# Altium schematic sheet BaseNode.SchDoc
size D
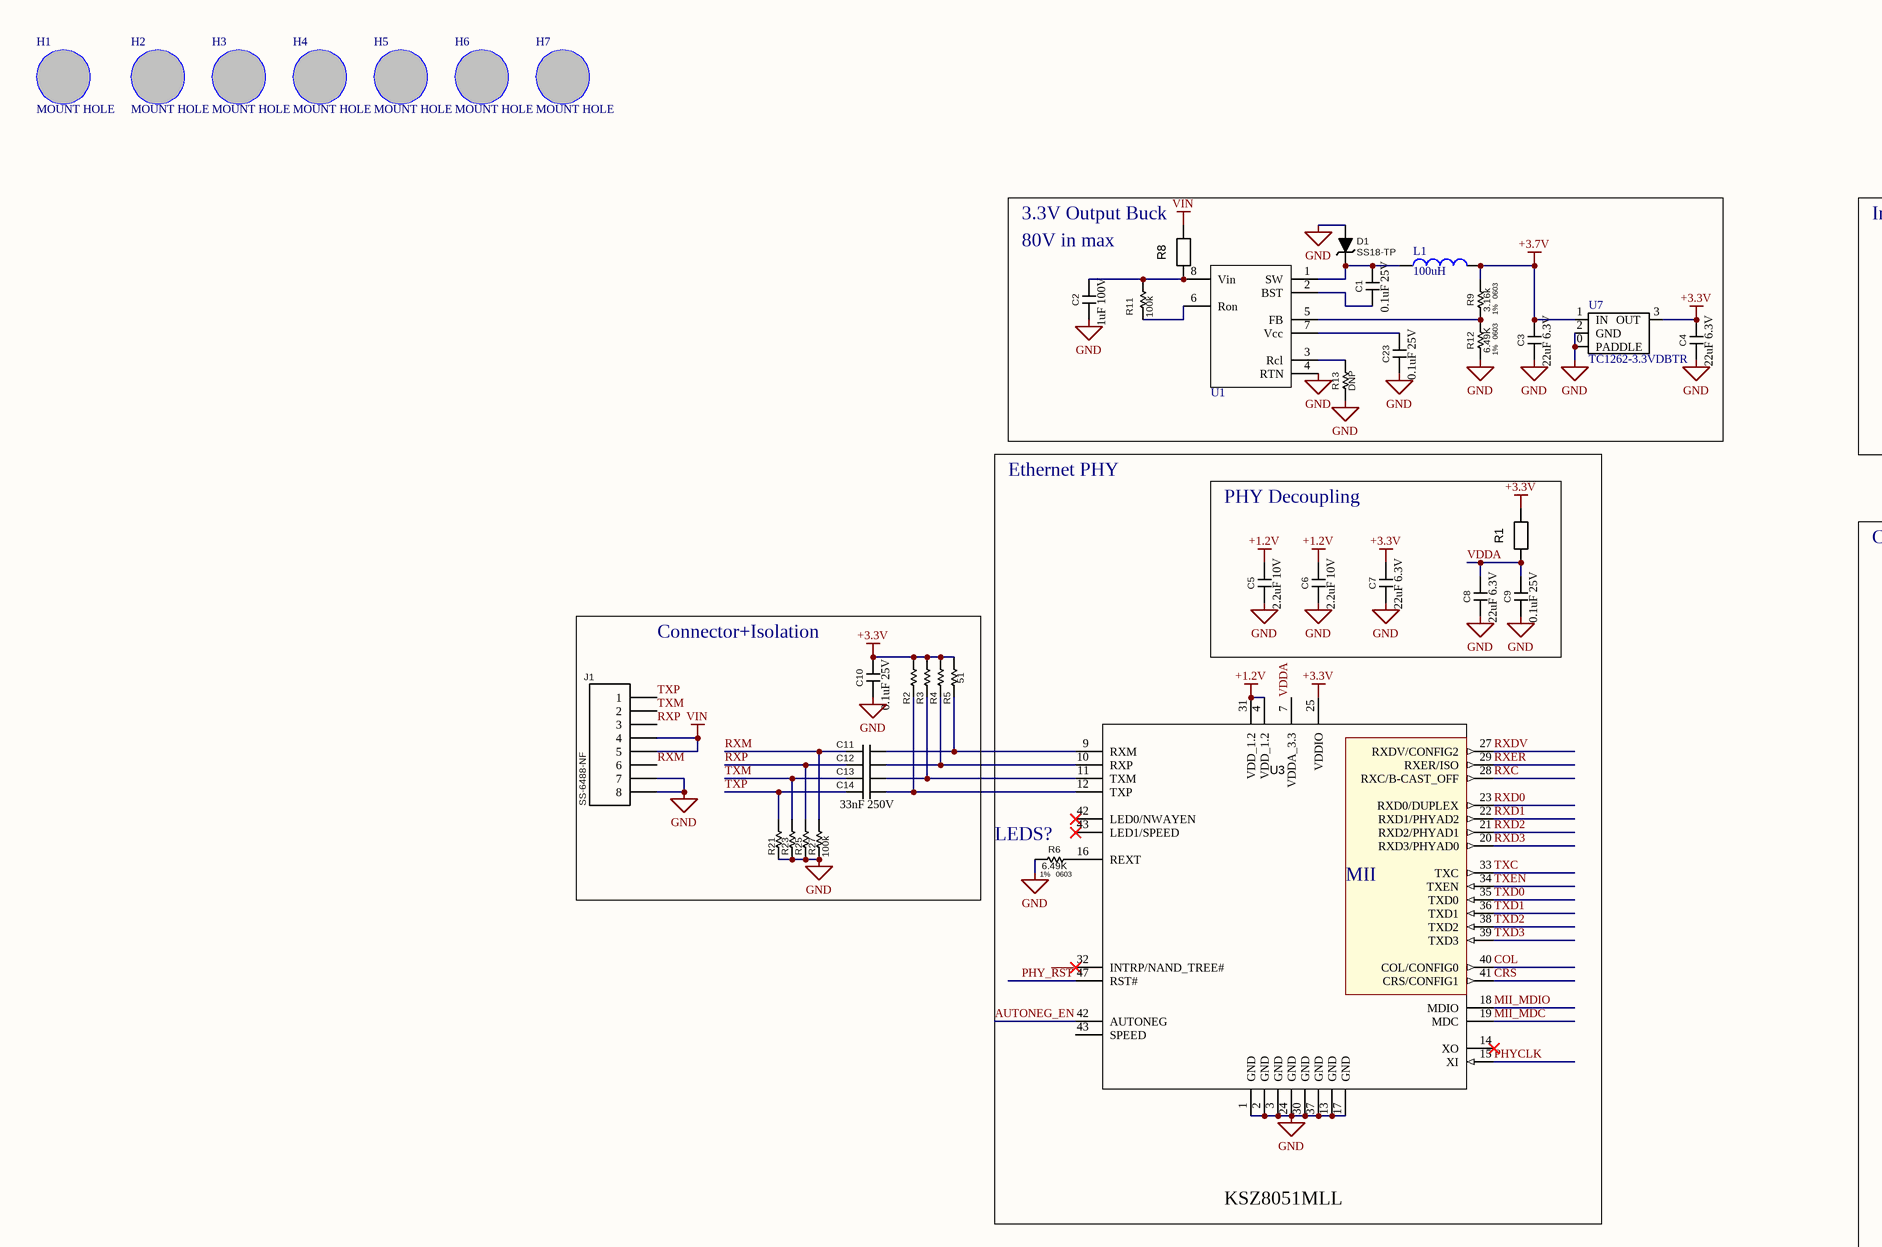
[diagram p0: BaseNode.SchDoc, top left]
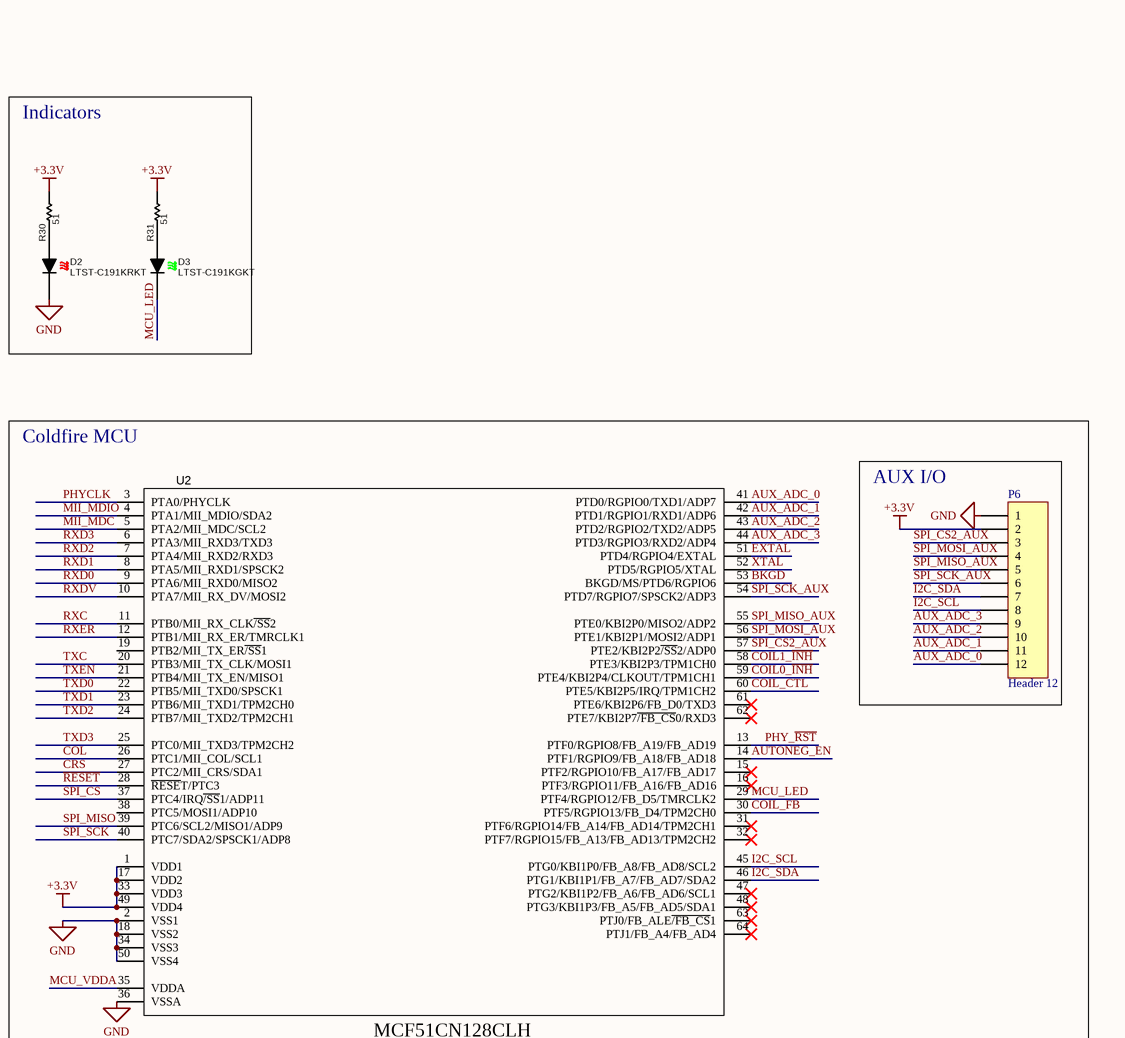
[diagram p1: BaseNode.SchDoc, top right]
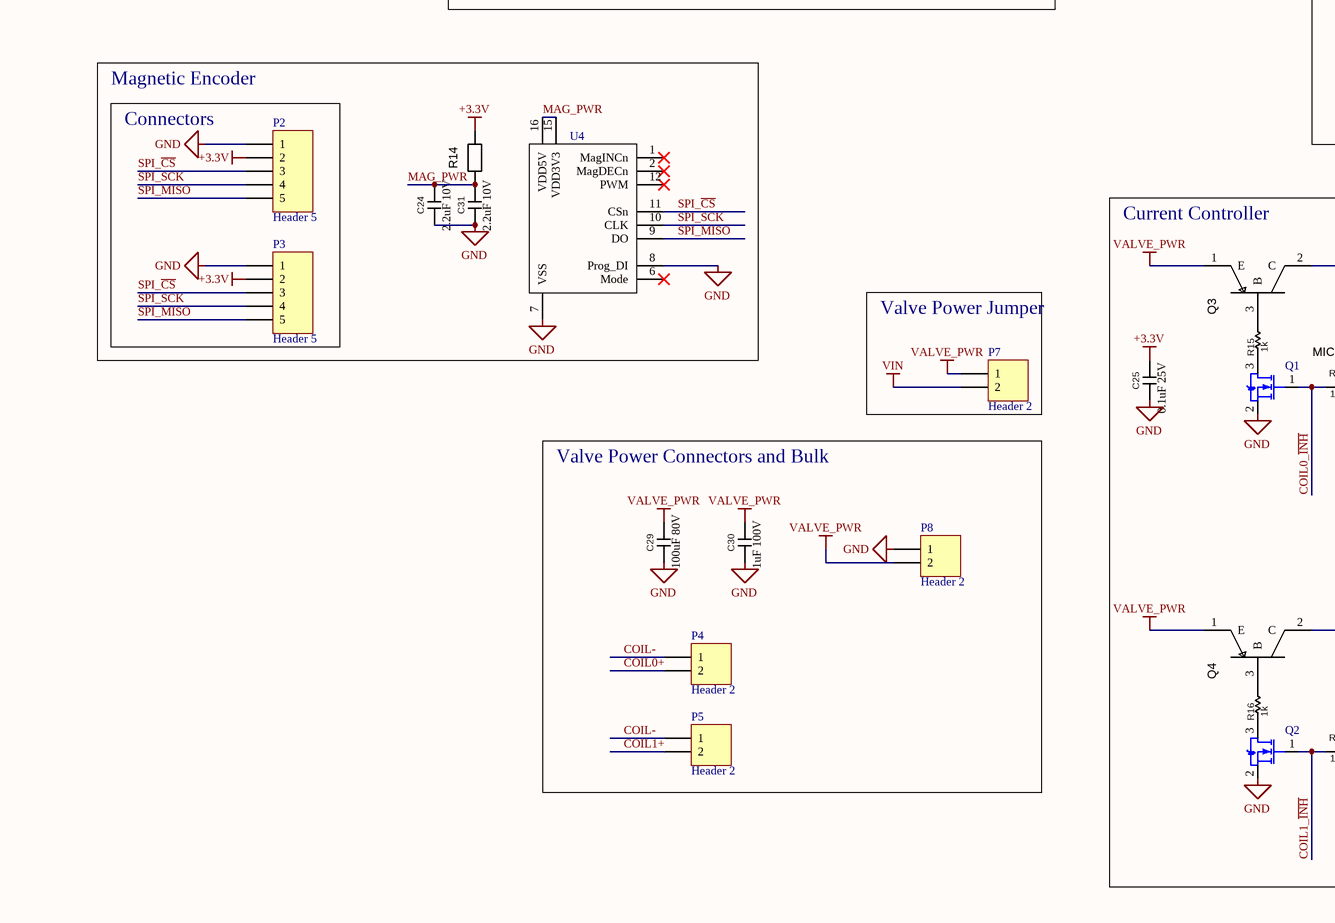
[diagram p2: BaseNode.SchDoc, bottom left]
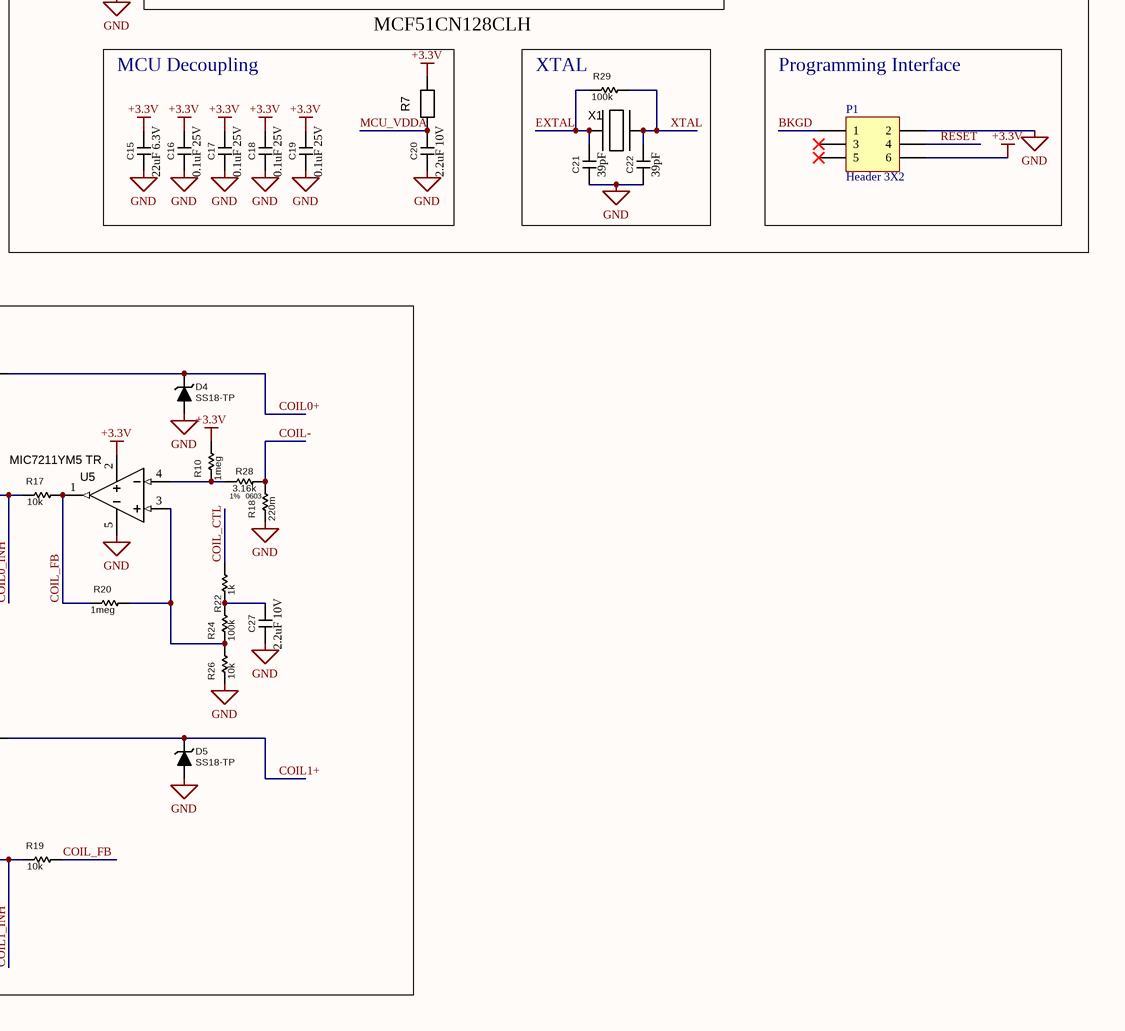
[diagram p3: BaseNode.SchDoc, bottom right]

## Parts
C1  0.1uF 25V  [0603]
C2  1uF 100V  [0805]
C3  22uF 6.3V  [1206]
C4  22uF 6.3V  [1206]
C5  2.2uF 10V  [0603]
C6  2.2uF 10V  [0603]
C7  22uF 6.3V  [1206]
C8  22uF 6.3V  [1206]
C9  0.1uF 25V  [0603]
C10  0.1uF 25V  [0603]
C11  33nF 250V  [0805]
C12  33nF 250V  [0805]  (value not drawn)
C13  33nF 250V  [0805]  (value not drawn)
C14  33nF 250V  [0805]  (value not drawn)
C15  22uF 6.3V  [1206]
C16  0.1uF 25V  [0603]
C17  0.1uF 25V  [0603]
C18  0.1uF 25V  [0603]
C19  0.1uF 25V  [0603]
C20  2.2uF 10V  [0603]
C21  39pF  [0603]
C22  39pF  [0603]
C23  0.1uF 25V  [0603]
C24  2.2uF 10V  [0603]
C25  0.1uF 25V  [0603]
C27  2.2uF 10V  [0603]
C29  100uF 80V  [Capacitor 12mm DIA POLAR]
C30  1uF 100V  [0805]
C31  2.2uF 10V  [0603]
D1  ManufacturerPN: SS18-TP  [SMA-DIODE]  (hidden comment: CDBA140-G)
D2  ManufacturerPN: LTST-C191KRKT  [0603 - LED]  (hidden comment: WP113IDT)
D3  ManufacturerPN: LTST-C191KGKT  [0603 - LED]  (hidden comment: WP113GDT)
D4  ManufacturerPN: SS18-TP  [SMA-DIODE]  (hidden comment: CDBA140-G)
D5  ManufacturerPN: SS18-TP  [SMA-DIODE]  (hidden comment: CDBA140-G)
H1  MOUNT HOLE  [MOUNT_HOLE]
H2  MOUNT HOLE  [MOUNT_HOLE]
H3  MOUNT HOLE  [MOUNT_HOLE]
H4  MOUNT HOLE  [MOUNT_HOLE]
H5  MOUNT HOLE  [MOUNT_HOLE]
H6  MOUNT HOLE  [MOUNT_HOLE]
H7  MOUNT HOLE  [MOUNT_HOLE]
J1  SS-6488-NF  [SS-6488-NF]
L1  value 100uH  [NR6028 Inductor]  (hidden comment: Inductor)
P1  Header 3X2  [HDR2X3]
P2  Header 5  [HDR1X5]
P3  Header 5  [HDR1X5]
P4  Header 2  [HDR1X2]
P5  Header 2  [HDR1X2]
P6  Header 12  [HDR1X12]
P7  Header 2  [HDR1X2]
P8  Header 2  [HDR1X2]
Q1  NFET  [SOT-23]  (value not drawn)
Q2  NFET  [SOT-23]  (value not drawn)
Q3  (no value)  [SOT-89 - PBSS305PX]
Q4  (no value)  [SOT-89 - PBSS305PX]
R1  LM4041EIM3X-1.2_1  [0603]  (value not drawn)
R2  51  [0603]
R3  51  [0603]  (value not drawn)
R4  51  [0603]  (value not drawn)
R5  51  [0603]  (value not drawn)
R6  6.49K  Tolerance: 1%  [0603]
R7  LM4041EIM3X-1.2_1  [0603]  (value not drawn)
R8  LM4041EIM3X-1.2_1  [0603]  (value not drawn)
R9  3.16k  Tolerance: 1%  [0603]
R10  1meg  [0603]
R11  100k  [0603]
R12  6.49K  Tolerance: 1%  [0603]
R13  DNP  [0603]
R14  LM4041EIM3X-1.2_1  [0603]  (value not drawn)
R15  1k  [0603]
R16  1k  [0603]
R17  10k  [0603]
R18  220m  [0805]
R19  10k  [0603]
R20  1meg  [0603]
R21  100k  [0603]  (value not drawn)
R22  1k  [0603]
R23  100k  [0603]  (value not drawn)
R24  100k  [0603]
R25  100k  [0603]  (value not drawn)
R26  10k  [0603]
R27  100k  [0603]
R28  3.16k  Tolerance: 1%  [0603]
R29  100k  [0603]
R30  51  [0603]
R31  51  [0603]
U1  LM5007MM/NOPB  [MSOP-8]  (value not drawn)
U2  MCF51CN128CLH  [LQFP-64 10x10mm .5mm pitch]  (value not drawn)
U3  KSZ8051MLL  [LQFP-48 7x7mm 0.5mm pitch]  (value not drawn)
U4  AS5045-ASSU  [SSOP-16]  (value not drawn)
U5  MIC7211YM5 TR  [SOT-23-5]
U7  TC1262-3.3VDBTR  [SOT-223]
X1  ECS-250-20-3X-EN-TR  [CSM-3X]  (value not drawn)

## Blocks framed on the sheet
Indicators: D2 D3 R30 R31
PHY Decoupling: C5-C9 R1
Coldfire MCU: U2
AUX I/O: P6
Connector+Isolation: C10-C14 J1 R2-R5 R21 R23 R25 R27
MCU Decoupling: C15-C20 R7
XTAL: C21 C22 R29 X1
Programming Interface: P1
Current Controller: C25 C27 D4 D5 Q1-Q4 R10 R15-R20 R22 R24 R26 R28 U5
Valve Power Jumper: P7
Valve Power Connectors and Bulk: C29 C30 P4 P5 P8

## Nets
+1.2V: C5.2 C6.2 U3.4(VDD_1.2) U3.31(VDD_1.2)
+3.3V: C4.2 C7.2 C10.2 C15.2 C16.2 C17.2 C18.2 C19.2 C25.2 P1.6 P2.2 P3.2 P6.2 R1.1(K) R2.2 R3.2 R4.2 R5.2 R7.1(K) R10.2 R14.1(K) R30.2 R31.2 U2.1(VDD1) U2.17(VDD2) U2.33(VDD3) U2.49(VDD4) U3.25(VDDIO) U5.2(V+) U7.3(OUT)
+3.7V: C3.2 L1.2 R9.2 U7.1(IN)
GND: C2.1 C3.1 C4.1 C5.1 C6.1 C7.1 C8.1 C9.1 C10.1 C15.1 C16.1 C17.1 C18.1 C19.1 C20.1 C21.1 C22.1 C23.1 C24.1 C25.1 C27.1 C29.1 C30.1 C31.1 D1.A D2.K D4.A D5.A J1.7 J1.8 P1.2 P2.1 P3.1 P6.1 P8.1 Q1.2 Q2.2 R6.1 R12.1 R13.1 R18.1 R21.1 R23.1 R25.1 R26.1 R27.1 U1.4(RTN) U2.2(VSS1) U2.18(VSS2) U2.34(VSS3) U2.36(VSSA) U2.50(VSS4) U3.1(GND) U3.2(GND) U3.3(GND) U3.13(GND) U3.17(GND) U3.24(GND) U3.30(GND) U3.37(GND) U4.7(VSS) U4.8(Prog_DI) U5.5(V-) U7.0(PADDLE) U7.2(GND)
VALVE_PWR: C29.2 C30.2 P7.1 P8.2 Q3.1(E) Q4.1(E)
VIN: J1.4 J1.5 P7.2 R8.1(K)
AUTONEG_EN: U2.14(PTF1/RGPIO9/FB_A18/FB_AD18) U3.42(LED0/NWAYEN)
AUX_ADC_0: P6.12 U2.41(PTD0/RGPIO0/TXD1/ADP7)
AUX_ADC_1: P6.11 U2.42(PTD1/RGPIO1/RXD1/ADP6)
AUX_ADC_2: P6.10 U2.43(PTD2/RGPIO2/TXD2/ADP5)
AUX_ADC_3: P6.9 U2.44(PTD3/RGPIO3/RXD2/ADP4)
BKGD: P1.1 U2.53(BKGD/MS/PTD6/RGPIO6)
COIL0+: D4.K P4.2 Q3.2(C)
COIL0_~{INH}: Q1.1(G) R17.1 U2.59(PTE4/KBI2P4/CLKOUT/TPM1CH1)
COIL1+: D5.K P5.2 Q4.2(C)
COIL1_~{INH}: Q2.1(G) R19.1 U2.58(PTE3/KBI2P3/TPM1CH0)
COIL-: P4.1 P5.1 R18.2 R28.2
COIL_CTL: R22.2 U2.60(PTE5/KBI2P5/IRQ/TPM1CH2)
COIL_FB: R17.2 R19.2 R20.1 U2.30(PTF5/RGPIO13/FB_D4/TPM2CH0) U5.1(Out_A)
COL: U2.26(PTC1/MII_COL/SCL1) U3.40(COL/CONFIG0)
CRS: U2.27(PTC2/MII_CRS/SDA1) U3.41(CRS/CONFIG1)
EXTAL: C21.2 R29.1 U2.51(PTD4/RGPIO4/EXTAL) X1.2(A)
I2C_SCL: P6.8 U2.45(PTG0/KBI1P0/FB_A8/FB_AD8/SCL2)
I2C_SDA: P6.7 U2.46(PTG1/KBI1P1/FB_A7/FB_AD7/SDA2)
MAG_PWR: C24.2 C31.2 R14.2(A) U4.15(VDD3V3) U4.16(VDD5V)
MCU_LED: D3.K U2.29(PTF4/RGPIO12/FB_D5/TMRCLK2)
MCU_VDDA: C20.2 R7.2(A) U2.35(VDDA)
MII_MDC: U2.5(PTA2/MII_MDC/SCL2) U3.19(MDC)
MII_MDIO: U2.4(PTA1/MII_MDIO/SDA2) U3.18(MDIO)
PHY_~{RST}: U2.13(PTF0/RGPIO8/FB_A19/FB_AD19) U3.47(RST#)
PHYCLK: U2.3(PTA0/PHYCLK) U3.15(XI)
~{RESET}: P1.4 U2.28(~{RESE}T/PTC3)
RXC: U2.11(PTB0/MII_RX_CLK~{/SS}2) U3.28(RXC/B-CAST_OFF)
RXD0: U2.9(PTA6/MII_RXD0/MISO2) U3.23(RXD0/DUPLEX)
RXD1: U2.8(PTA5/MII_RXD1/SPSCK2) U3.22(RXD1/PHYAD2)
RXD2: U2.7(PTA4/MII_RXD2/RXD3) U3.21(RXD2/PHYAD1)
RXD3: U2.6(PTA3/MII_RXD3/TXD3) U3.20(RXD3/PHYAD0)
RXDV: U2.10(PTA7/MII_RX_DV/MOSI2) U3.27(RXDV/CONFIG2)
RXER: U2.12(PTB1/MII_RX_ER/TMRCLK1) U3.29(RXER/ISO)
RXM: C11.1 J1.6 R27.2
RXP: C12.1 J1.3 R25.2
SPI_~{CS}: P2.3 P3.3 U2.37(PTC4/IRQ~{/SS}1/ADP11) U4.11(CSn)
SPI_~{CS2}_AUX: P6.3 U2.57(PTE2/KBI2P2~{/SS}2/ADP0)
SPI_MISO: P2.5 P3.5 U2.39(PTC6/SCL2/MISO1/ADP9) U4.9(DO)
SPI_MISO_AUX: P6.5 U2.55(PTE0/KBI2P0/MISO2/ADP2)
SPI_MOSI_AUX: P6.4 U2.56(PTE1/KBI2P1/MOSI2/ADP1)
SPI_SCK: P2.4 P3.4 U2.40(PTC7/SDA2/SPSCK1/ADP8) U4.10(CLK)
SPI_SCK_AUX: P6.6 U2.54(PTD7/RGPIO7/SPSCK2/ADP3)
TXC: U2.20(PTB3/MII_TX_CLK/MOSI1) U3.33(TXC)
TXD0: U2.22(PTB5/MII_TXD0/SPSCK1) U3.35(TXD0)
TXD1: U2.23(PTB6/MII_TXD1/TPM2CH0) U3.36(TXD1)
TXD2: U2.24(PTB7/MII_TXD2/TPM2CH1) U3.38(TXD2)
TXD3: U2.25(PTC0/MII_TXD3/TPM2CH2) U3.39(TXD3)
TXEN: U2.21(PTB4/MII_TX_EN/MISO1) U3.34(TXEN)
TXM: C13.1 J1.2 R23.2
TXP: C14.1 J1.1 R21.2
VDDA: C8.2 C9.2 R1.2(A) U3.7(VDDA_3.3)
XTAL: C22.2 R29.2 U2.52(PTD5/RGPIO5/XTAL) X1.1(K)
NetC1_1: C1.1 U1.2(BST)
NetC1_2: C1.2 D1.K L1.1 U1.1(SW)
NetC2_2: C2.2 R8.2(A) R11.2 U1.8(Vin)
NetC11_2: C11.2 R5.1 U3.9(RXM)
NetC12_2: C12.2 R4.1 U3.10(RXP)
NetC13_2: C13.2 R3.1 U3.11(TXM)
NetC14_2: C14.2 R2.1 U3.12(TXP)
NetC23_2: C23.2 U1.7(Vcc)
NetC27_2: C27.2 R22.1 R24.2
NetD2_A: D2.A R30.1
NetD3_A: D3.A R31.1
NetQ1_3: Q1.3 R15.1
NetQ2_3: Q2.3 R16.1
NetQ3_3: Q3.3(B) R15.2
NetQ4_3: Q4.3(B) R16.2
NetR6_2: R6.2 U3.16(REXT)
NetR9_1: R9.1 R12.2 U1.5(FB)
NetR10_1: R10.1 R28.1 U5.4(IN-_A)
NetR11_1: R11.1 U1.6(Ron)
NetR13_2: R13.2 U1.3(Rcl)
NetR20_2: R20.2 R24.1 R26.2 U5.3(IN+_A)

Not connected (* = marked no-connect by the designer): P1 3* 5*; U2 15(PTF2/RGPIO10/FB_A17/FB_AD17)* 16(PTF3/RGPIO11/FB_A16/FB_AD16)* 19(PTB2/MII_TX_ER~{/SS}1) 31(PTF6/RGPIO14/FB_A14/FB_AD14/TPM2CH1)* 32(PTF7/RGPIO15/FB_A13/FB_AD13/TPM2CH2)* 38(PTC5/MOSI1/ADP10) 47(PTG2/KBI1P2/FB_A6/FB_AD6/SCL1)* 48(PTG3/KBI1P3/FB_A5/FB_AD5/SDA1)* 61(PTE6/KBI2P6/FB_D0/TXD3)* 62(PTE7/KBI2P7~{/FB_CS}0/RXD3)* 63(PTJ0/FB_ALE~{/FB_CS}1)* 64(PTJ1/FB_A4/FB_AD4)*; U3 14(XO)* 32(INTRP/NAND_TREE#)* 43(LED1/SPEED)*; U4 1(MagINCn)* 2(MagDECn)* 6(Mode)* 12(PWM)*

## Notes on the sheet
- (near R8) 3.3V Output Buck
- 80V in max
- Ethernet PHY
- (near R6) LEDS?
- Magnetic Encoder
- (near P2) Connectors
- Title
- Size:
- Date:
- File:
- D
- Number:
- Time:
- Revision:
- Sheet
- of
- (in symbol KSZ8051MLL) MII

## Library data of the parts
C1 C9 C10 C16-C19 C23 C25 = Capacitor: Manufacturer: Murata Electronics North America; ManufacturerPN: GRM188R71E104KA01D; Vendor: Digi-Key; VendorPN: 490-1524-1-ND; ComponentLink1Description: Datasheet; ComponentLink1URL: http://search.murata.co.jp/Ceramy/image/img/w_hinm/L0005E.pdf; Value: 0.1uF 25V
C2 C30 = Capacitor: Manufacturer: TDK Corporation; ManufacturerPN: C2012X7S2A105K; Vendor: Digi-Key; VendorPN: 445-5205-1-ND; ComponentLink1Description: Datasheet; Value: 1uF 100V
C3 C4 C7 C8 C15 = Capacitor: Manufacturer: Taiyo Yuden; ManufacturerPN: JMK316B7226ML-T; Vendor: Digi-Key; VendorPN: 587-1334-1-ND; ComponentLink1Description: Datasheet; ComponentLink1URL: http://www.yuden.co.jp/productdata/catalog/en/mlcc01_e.pdf; Value: 22uF 6.3V
C5 C6 C20 C24 C27 C31 = Capacitor: Manufacturer: Taiyo Yuden; ManufacturerPN: LMK107BJ225KA-T; Vendor: Digi-Key; VendorPN: 587-1253-1-ND; ComponentLink1Description: Datasheet; ComponentLink1URL: http://www.yuden.co.jp/productdata/catalog/en/mlcc01_e.pdf; Value: 2.2uF 10V
C11-C14 = Capacitor: Manufacturer: TDK Corporation; ManufacturerPN: C2012X7T2E333K; Vendor: Digi-Key; VendorPN: 445-7746-1-ND; ComponentLink1Description: Datasheet; ComponentLink1URL: http://www.tdk.com/pdf/mid_volt_B11.pdf; Value: 33nF 250V
C21 C22 = Capacitor: Manufacturer: TDK Corporation; ManufacturerPN: C1608C0G1H390J; Vendor: Digi-Key; VendorPN: 445-1276-1-ND; ComponentLink1Description: Datasheet; ComponentLink1URL: http://www.tdk.com/pdf/general_B11.pdf; Value: 39pF
C29 = Capacitor: Manufacturer: Panasonic Electronic Components; ManufacturerPN: EEE-FK1K151AQ; Vendor: Digi-Key; VendorPN: PCE4857DKR-ND; ComponentLink1Description: Datasheet; Value: 100uF 80V
D1 D4 D5 = CDBA140-G: DIODE SCHOTTKY 40V 1A SMA; Manufacturer: Micro Commercial Co; Vendor: Digi-Key; VendorPN: SS18-TPCT-ND; Package: SMA; ComponentLink1URL: http://61.222.192.61/mccsemi/up_pdf/SS12-SS110(HSMA).PDF; ComponentLink1Description: Datasheet
D2 = WP113IDT: LED RECT 2X5MM 625NM RED DIFF; Manufacturer: Lite-On Inc; Vendor: Digi-Key; VendorPN: 160-1447-1-ND; ComponentLink1URL: http://optoelectronics.liteon.com/en-us/api/DwonloadFileHandler.ashx?txtSpecNo=DS22-2000-223&txtPartNo=LTST-C191KRKT; ComponentLink1Description: Datasheet
D3 = WP113GDT: LED RECT 2X5MM 568NM GRN DIFF; Manufacturer: Lite-On Inc; Vendor: Digi-Key; VendorPN: 160-1446-1-ND; ComponentLink1URL: http://optoelectronics.liteon.com/en-us/api/DwonloadFileHandler.ashx?txtSpecNo=DS22-2000-228&txtPartNo=LTST-C191KGKT; ComponentLink1Description: Datasheet
J1 = SS-6488-NF: CONN 8-8 MOD JACK; Manufacturer: Stewart Connector; Vendor: Digi-Key; VendorPN: 380-1022-ND; ManufacturerPN: SS-6488-NF; ComponentLink1Description: Datasheet; ComponentLink1URL: http://www.belfuse.com/Data/Datasheets/CT640041.pdf
L1 = Inductor: Manufacturer: Taiyo Yuden; ManufacturerPN: NR6028T101M; Vendor: Digi-Key; VendorPN: 587-2105-1-ND; PackageDescription: Chip Inductor; ComponentLink1Description: Datasheet; ComponentLink1URL: http://www.yuden.co.jp/ut/product/pdf/wound04_e.pdf
P1 = Header 3X2: Header, 3-Pin, Dual row; LatestRevisionDate: 17-Jul-2002; LatestRevisionNote: Re-released for DXP Platform.; Publisher: Altium Limited
P2 P3 = Header 5: Header, 5-Pin; LatestRevisionDate: 17-Jul-2002; LatestRevisionNote: Re-released for DXP Platform.; Publisher: Altium Limited
P4 P5 P7 P8 = Header 2: Header, 2-Pin; LatestRevisionDate: 17-Jul-2002; LatestRevisionNote: Re-released for DXP Platform.; Publisher: Altium Limited
P6 = Header 12: Header, 12-Pin; LatestRevisionDate: 17-Jul-2002; LatestRevisionNote: Re-released for DXP Platform.; Publisher: Altium Limited
Q1 Q2 = BSS123: FET N-CH 100V 170MA SOT-23; Manufacturer: Fairchild Semiconductor; Vendor: Digikey; VendorPN: BSS123NTR-ND; ManufacturerPN: BSS123; ComponentLink1URL: http://www.fairchildsemi.com/ds/BS/BSS123.pdf; ComponentLink1Description: Datasheet
Q3 Q4 = PBSS305PX,115: TRANS PNP 80V 4A SOT89; Manufacturer: NXP Semiconductors; Vendor: Digi-Key; VendorPN: 568-4178-1-ND; ManufacturerPN: PBSS305PX,115; ComponentLink1Description: Datasheet; ComponentLink1URL: http://www.nxp.com/documents/data_sheet/PBSS305PX.pdf
R1 R7 R8 R14 = LM4041EIM3X-1.2_1: Ferrite; Manufacturer: TDK Corporation; ManufacturerPN: MMZ1608B601C; Vendor: Digi-Key; VendorPN: 445-2166-1-ND; ComponentLink1Description: Datasheet; ComponentLink1URL: http://www.tdk.co.jp/tefe02/e9412_mmz.pdf
R2-R5 R30 R31 = Resistor: Manufacturer: Yageo; ManufacturerPN: RC0603JR-0751RL; Vendor: Digi-Key; VendorPN: 311-51GRCT-ND; Tolerance: 5%; ComponentLink1Description: Datasheet; ComponentLink1URL: http://www.yageo.com/documents/recent/PYu-RC0603_51_RoHS_L_4.pdf; Power: *; Value: 51; Package: 0603
R6 R12 = Resistor: Manufacturer: Yageo; ManufacturerPN: RC0603FR-076K49L; Vendor: Digi-Key; VendorPN: 311-6.49KHRCT-ND; ComponentLink1Description: Datasheet; Power: *; Value: 6.49K; Package: 0603
R9 R28 = Resistor: Manufacturer: Yageo; ManufacturerPN: RC0603FR-073K16L; Vendor: Digi-Key; VendorPN: 311-3.16KHRCT-ND; ComponentLink1Description: Datasheet; Power: *; Value: 3.16k; Package: 0603
R10 R20 = Resistor: Manufacturer: Yageo; ManufacturerPN: RC0603JR-071ML; Vendor: Digi-Key; VendorPN: 311-1.0MGRCT-ND; Tolerance: 5%; ComponentLink1Description: Datasheet; Power: *; Value: 1meg; Package: 0603
R11 R21 R23-R25 R27 R29 = Resistor: Manufacturer: Yageo; Vendor: Digi-Key; VendorPN: 311-100KHRCT-ND; ComponentLink1Description: Datasheet; Power: *; Value: 100k; Package: 0603
R13 = Resistor: Vendor: Digi-Key; Tolerance: 1%; ComponentLink1Description: Datasheet; Power: *; Value: DNP; Package: 0603
R15 R16 R22 = Resistor: Manufacturer: Yageo; ManufacturerPN: RC0603JR-071KL; Vendor: Digi-Key; VendorPN: 311-1.0KGRCT-ND; Tolerance: 5%; ComponentLink1Description: Datasheet; Power: *; Value: 1k; Package: 0603
R17 R19 R26 = Resistor: Manufacturer: Yageo; ManufacturerPN: RC0603FR-0710KL; Vendor: Digi-Key; VendorPN: 311-10.0KHRCT-ND; ComponentLink1Description: Datasheet; Power: *; Value: 10k; Package: 0603
R18 = Resistor: Manufacturer: Susumu; ManufacturerPN: RL1220S-R22-F; Vendor: Digi-Key; VendorPN: RL12S.22FCT-ND; ComponentLink1Description: Datasheet; Power: *; Value: 220m; Package: 0805
U1 = LM5007MM/NOPB: BUCK ADJ .5A 8MSOP; Manufacturer: National Semiconductor; Vendor: Digikey; VendorPN: LM5007MMCT-ND; ManufacturerPN: LM5007MM/NOPB; ComponentLink1URL: http://www.ti.com/lit/ds/symlink/lm5007.pdf; ComponentLink1Description: Datasheet
U2 = MCF51CN128CLH: MCU Coldfire w/ Ethernet; Manufacturer: Freescale Semiconductor; Vendor: Digikey; VendorPN: MCF51CN128CLH-ND; ComponentLink1Description: Datasheet; ComponentLink1URL: http://www.freescale.com/files/32bit/doc/data_sheet/MCF51CN128.pdf?pspll=1; ManufacturerPN: MCF51CN128CLH
U3 = KSZ8051MLL: Ethernet PHY MII; Manufacturer: Micrel Inc; Vendor: Digikey; VendorPN: 576-3731-ND; ComponentLink1Description: Datasheet; ComponentLink1URL: http://www.micrel.com/_PDF/Ethernet/datasheets/ksz8051mll.pdf; ManufacturerPN: KSZ8051MLL
U4 = AS5045-ASSU: IC ENCODER PROG 12-BIT 16-SSOP; Manufacturer: AMS; Vendor: Digikey; VendorPN: AS5045-ASSU-ND; ManufacturerPN: AS5045-ASSU; ComponentLink1URL: http://www.austriamicrosystems.com/eng/content/download/1288/7223; ComponentLink1Description: Datasheet
U5 = MIC7221YM5 TR: IC COMPARATOR R-R SOT-23-5; Manufacturer: Micrel Inc; Vendor: Digi-key; VendorPN: 576-1318-1-ND; ComponentLink1Description: Datasheet; ComponentLink1URL: http://www.micrel.com/_PDF/mic7211.pdf; ManufacturerPN: MIC7211YM5 TR
U7 = TC1262-3.3VDBTR: Regulator IC CMOS LDO 3.3V 500MA SOT223-3; Manufacturer: Microchip Technology; Vendor: Digikey; VendorPN: TC1262-3.3VDBCT-ND; ComponentLink1URL: http://ww1.microchip.com/downloads/en/DeviceDoc/21373b.pdf; ComponentLink1Description: Datasheet; ManufacturerPN: TC1262-3.3VDBTR
X1 = ECS-250-20-3X-EN-TR: CRYSTAL 25.00000 MHZ 20PF SMD; Manufacturer: ECS Inc; Vendor: Digi-Key; VendorPN: XC1798CT-ND; ManufacturerPN: ECS-250-20-3X-EN-TR; ComponentLink1Description: Datasheet; ComponentLink1URL: http://www.ecsxtal.com/store/pdf/CSM-3X.pdf